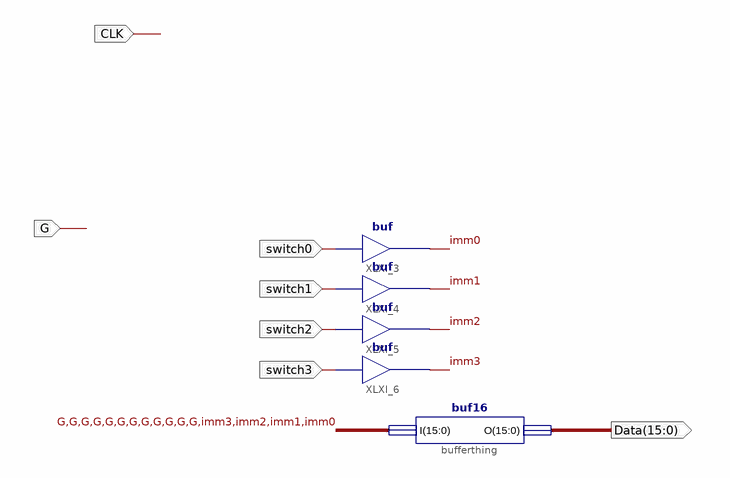
[diagram p0: schematic sheet 1]
// Xilinx ISE schematic SwitchtoAcc.sch (spartan3e) as structural Verilog: 5 symbols, 7 ports
module SwitchtoAcc (
  input  CLK,
  input  switch0,
  input  switch1,
  input  switch2,
  input  switch3,
  input  G,
  output [15:0] Data
);

  wire imm0, imm1, imm2, imm3;

  buf XLXI_3 (imm0, switch0);
  buf XLXI_4 (imm1, switch1);
  buf XLXI_5 (imm2, switch2);
  buf XLXI_6 (imm3, switch3);
  buf16 bufferthing (.I({{12{G}}, imm3, imm2, imm1, imm0}), .O(Data));
endmodule
